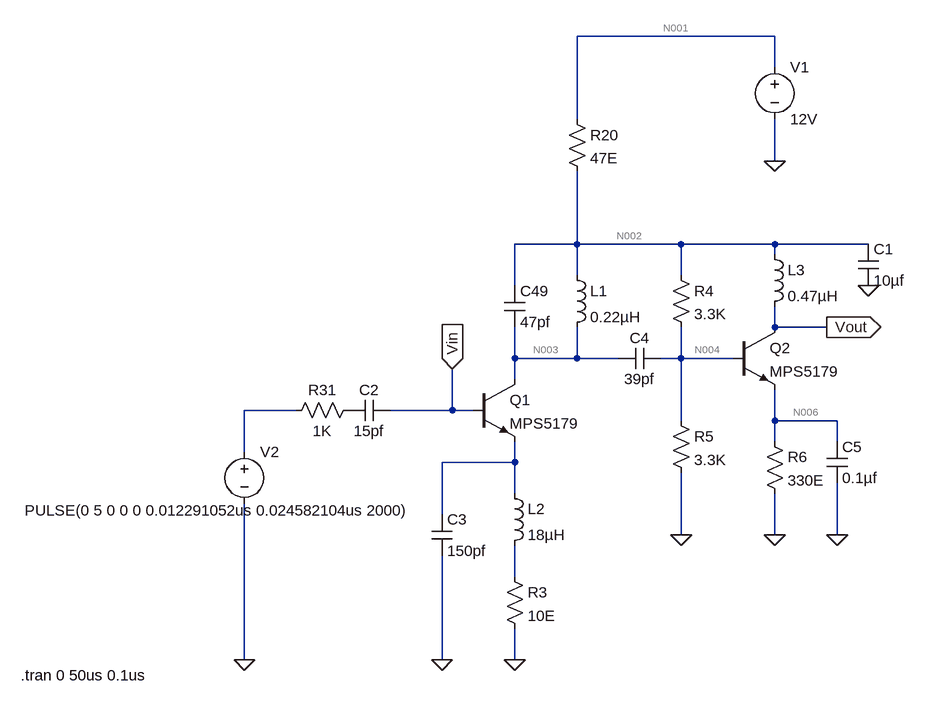
[diagram p0: schematic MPS5179_Cascaded.asc]
MPS5179_Cascaded.asc, the LTspice schematic file:
Version 4
SHEET 1 1496 680
WIRE 608 -432 304 -432
WIRE 608 -384 608 -432
WIRE 304 -304 304 -432
WIRE 608 -240 608 -304
WIRE 304 -112 304 -224
WIRE 304 -112 208 -112
WIRE 464 -112 304 -112
WIRE 608 -112 464 -112
WIRE 752 -112 608 -112
WIRE 608 -96 608 -112
WIRE 304 -64 304 -112
WIRE 464 -64 464 -112
WIRE 208 -48 208 -112
WIRE 608 16 608 -16
WIRE 688 16 608 16
WIRE 208 64 208 16
WIRE 304 64 304 16
WIRE 304 64 208 64
WIRE 368 64 304 64
WIRE 464 64 464 16
WIRE 464 64 432 64
WIRE 544 64 464 64
WIRE 208 96 208 64
WIRE -128 144 -208 144
WIRE 112 144 112 80
WIRE 112 144 16 144
WIRE 144 144 112 144
WIRE 464 160 464 64
WIRE 608 160 608 112
WIRE 704 160 608 160
WIRE 608 192 608 160
WIRE 704 192 704 160
WIRE -208 208 -208 144
WIRE 208 224 208 192
WIRE 208 224 96 224
WIRE 208 272 208 224
WIRE 96 304 96 224
WIRE 464 336 464 240
WIRE 608 336 608 272
WIRE 704 336 704 256
WIRE 208 400 208 352
WIRE -208 528 -208 288
WIRE 96 528 96 368
WIRE 208 528 208 480
FLAG 608 -240 0
FLAG 96 528 0
FLAG 208 528 0
FLAG -208 528 0
FLAG 464 336 0
FLAG 608 336 0
FLAG 704 336 0
FLAG 752 -48 0
FLAG 112 80 Vin
IOPIN 112 80 In
FLAG 688 16 Vout
IOPIN 688 16 Out
SYMBOL cap 192 -48 R0
SYMATTR InstName C49
SYMATTR Value 47pf
SYMBOL ind 288 -80 R0
SYMATTR InstName L1
SYMATTR Value 0.22µH
SYMBOL cap 80 304 R0
SYMATTR InstName C3
SYMATTR Value 150pf
SYMBOL ind 192 256 R0
SYMATTR InstName L2
SYMATTR Value 18µH
SYMBOL res 192 384 R0
SYMATTR InstName R3
SYMATTR Value 10E
SYMBOL res 288 -320 R0
SYMATTR InstName R20
SYMATTR Value 47E
SYMBOL voltage 608 -400 R0
SYMATTR InstName V1
SYMATTR Value 12V
SYMBOL cap 16 128 R90
WINDOW 0 0 32 VBottom 2
WINDOW 3 32 32 VTop 2
SYMATTR InstName C2
SYMATTR Value 15pf
SYMBOL res -32 128 R90
WINDOW 0 0 56 VBottom 2
WINDOW 3 32 56 VTop 2
SYMATTR InstName R31
SYMATTR Value 1K
SYMBOL voltage -208 192 R0
WINDOW 3 -338 106 Left 2
SYMATTR Value PULSE(0 5 0 0 0 0.012291052us 0.024582104us 2000)
SYMATTR InstName V2
SYMBOL npn 144 96 R0
SYMATTR InstName Q1
SYMATTR Value MPS5179
SYMBOL npn 544 16 R0
SYMATTR InstName Q2
SYMATTR Value MPS5179
SYMBOL cap 432 48 R90
WINDOW 0 0 32 VBottom 2
WINDOW 3 32 32 VTop 2
SYMATTR InstName C4
SYMATTR Value 39pf
SYMBOL res 448 -80 R0
SYMATTR InstName R4
SYMATTR Value 3.3K
SYMBOL res 448 144 R0
SYMATTR InstName R5
SYMATTR Value 3.3K
SYMBOL res 592 176 R0
SYMATTR InstName R6
SYMATTR Value 330E
SYMBOL cap 688 192 R0
SYMATTR InstName C5
SYMATTR Value 0.1µf
SYMBOL ind 592 -112 R0
SYMATTR InstName L3
SYMATTR Value 0.47µH
SYMBOL cap 736 -112 R0
SYMATTR InstName C1
SYMATTR Value 10µf
TEXT -552 552 Left 2 !.tran 0 50us 0.1us

The netlist it stands for:
* MPS5179_Cascaded.asc
C49 N002 N003 47pf
L1 N002 N003 0.22µH
C3 N007 0 150pf
L2 N007 N008 18µH
R3 N008 0 10E
R20 N001 N002 47E
V1 N001 0 12V
C2 Vin P001 15pf
R31 P001 N005 1K
V2 N005 0 PULSE(0 5 0 0 0 0.012291052us 0.024582104us 2000)
Q1 N003 Vin N007 0 MPS5179
Q2 Vout N004 N006 0 MPS5179
C4 N004 N003 39pf
R4 N002 N004 3.3K
R5 N004 0 3.3K
R6 N006 0 330E
C5 N006 0 0.1µf
L3 N002 Vout 0.47µH
C1 N002 0 10µf
.model NPN NPN
.model PNP PNP
.lib standard.bjt
.tran 0 50us 0.1us
.backanno
.end

* Results of the author's LTspice run, read from the files saved beside the schematic
* Operating Point, zero values left out:
*   V(n002) = 11.27 V
*   V(n003) = 11.27 V
*   V(n001) = 12 V
*   V(vin) = 329.3 mV
*   V(vout) = 11.27 V
*   V(n004) = 5.378 V
*   V(n006) = 4.561 V
*   Ic(Q2) = 13.66 mA
*   Ib(Q2) = 156.7 µA
*   Ie(Q2) = -13.82 mA
*   Ic(Q1) = 242 pA
*   Ie(Q1) = -242 pA
*   I(L3) = 13.66 mA
*   I(L2) = 242 pA
*   I(L1) = 241.6 pA
*   I(R6) = 13.82 mA
*   I(R5) = 1.63 mA
*   I(R4) = 1.786 mA
*   I(R20) = 15.45 mA
*   I(R3) = 242 pA
*   I(V1) = -15.45 mA